# EAGLE design Op-amp Microphone Preamp (EAGLE 6.2)
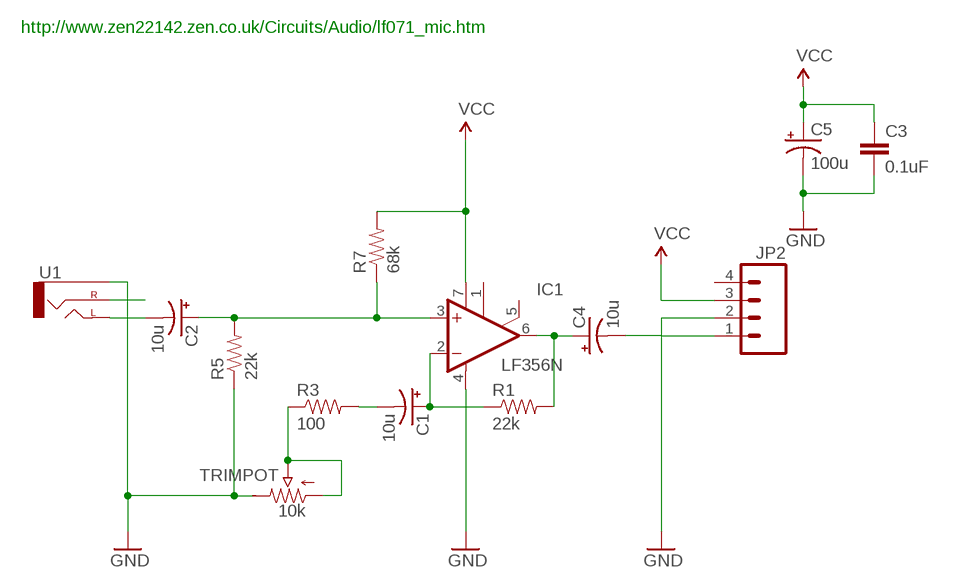
[diagram p0: schematic, sheet 1]

## Parts
C1  10u  CAP_POLPTH1  [CPOL-RADIAL-100UF-25V]
C2  10u  CAP_POLPTH1  [CPOL-RADIAL-100UF-25V]
C3  0.1uF  CAPPTH  [CAP-PTH-SMALL]
C4  10u  CAP_POLPTH1  [CPOL-RADIAL-100UF-25V]
C5  100u  CAP_POLPTH1  [CPOL-RADIAL-100UF-25V]
IC1  LF356N  [DIL08]
JP2  M04POLAR  [MOLEX-1X4]
R1  22k  RESISTORPTH-1/6W  [1/6W-RES]
R3  100  RESISTORPTH-1/6W  [1/6W-RES]
R5  22k  RESISTORPTH-1/6W  [1/6W-RES]
R7  68k  RESISTORPTH-1/6W  [1/6W-RES]
TRIMPOT  10k  POT100K_3362U  [3362U]
U1  AUDIO-JACKPTH  [AUDIO-JACK]

## Nets
GND: C3.2 C5.2(-) IC1.4(V-) JP2.2 R5.1 TRIMPOT.P$1(E) U1.SLEEVE
N$2: C1.2(-) R3.2
N$3: C4.1(+) IC1.6(OUT) R1.2
N$4: R3.1 TRIMPOT.P$2(S) TRIMPOT.P$3(A)
N$5: C1.1(+) IC1.2(-IN) R1.1
N$6: C2.1(+) IC1.3(+IN) R5.2 R7.1
N$8: C2.2(-) U1.TIP(LEFT)
N$9: U1.RING(RIGHT)
N$13: C4.2(-) JP2.1
VCC: C3.1 C5.1(+) IC1.7(V+) JP2.3 R7.2
Unconnected: IC1.1(BALANCE1) IC1.5(BALANCE2) JP2.4

## Notes on the sheet
- http://www.zen22142.zen.co.uk/Circuits/Audio/lf071_mic.htm

## Library data of the parts
C1 C2 C4 C5 = SparkFun:CAP_POL: Capacitor Polarized These are standard SMD and PTH capacitors. Normally 10uF, 47uF, and 100uF in electrolytic and tantalum varieties. Always verify the external diameter of the through hole cap, it varies with capacity, voltage, and manufacturer. The EIA devices should be standard.
C3 = SparkFun:CAP: Capacitor Standard 0603 ceramic capacitor, and 0.1" leaded capacitor.
IC1 = My Library:LF356: OP AMP
JP2 = SparkFun:M04: Header 4 Standard 4-pin 0.1" header. Use with straight break away headers (SKU : PRT-00116), right angle break away headers (PRT-00553), swiss pins (PRT-00743), machine pins (PRT-00117), and female headers (PRT-00115). Molex polarized connector foot print use with SKU : PRT-08231 with associated crimp pins and housings. 1MM SMD Version SKU: PRT-10208
R1 = My Library:RESISTOR: Resistor Basic schematic elements and footprints for 0603, 1206, and PTH resistors.
R3 R5 R7 = SparkFun:RESISTOR: Resistor Basic schematic elements and footprints for 0603, 1206, and PTH resistors.
TRIMPOT = My Library:POT
U1 = SparkFun:AUDIO-JACK: 3.5mm Audio Jack Simple 3.5mm common PCB mount audio jack. SKU: PRT-08032

## Board
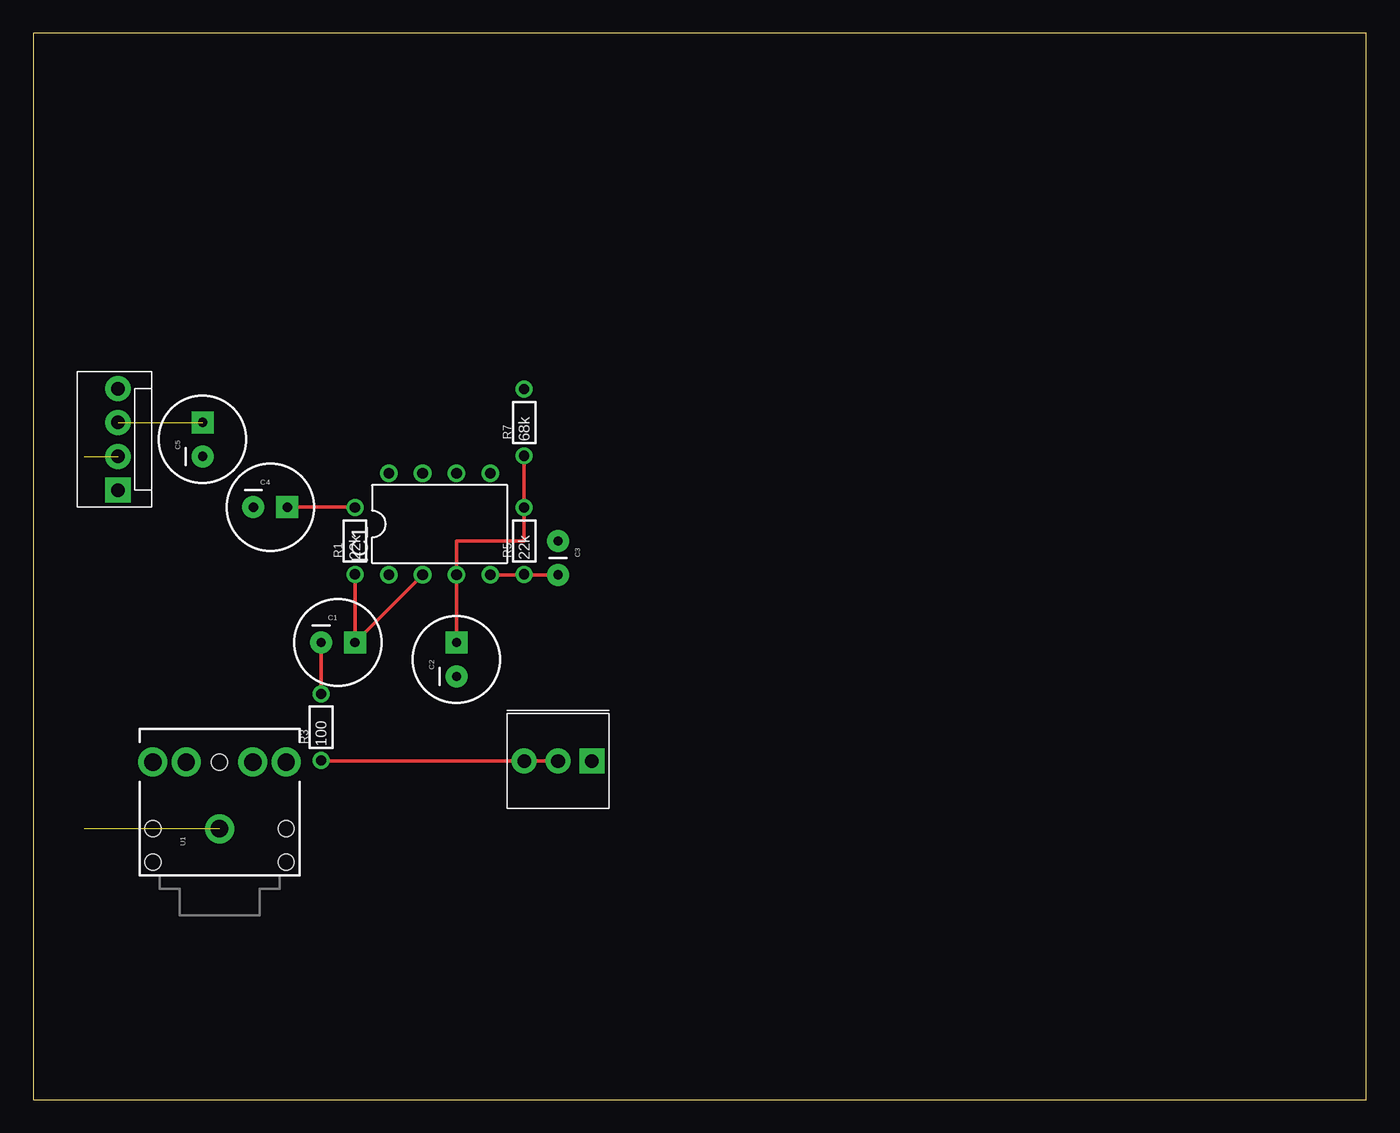
[diagram p1: board, top side]
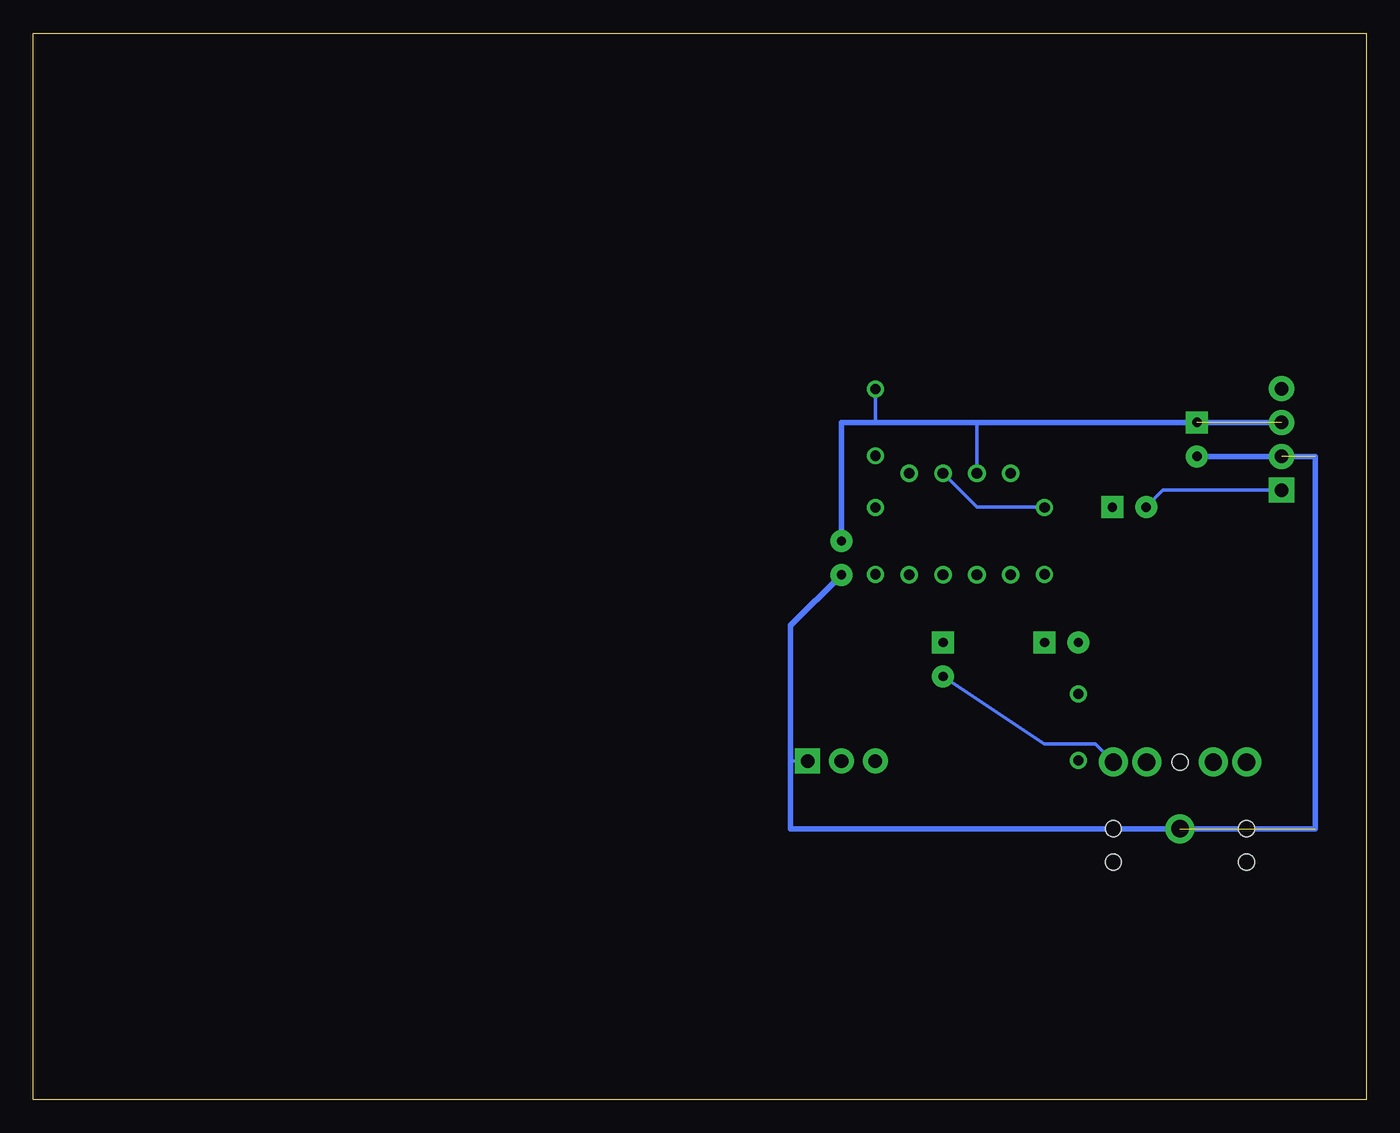
[diagram p2: board, bottom side, seen from below]

Size 100 x 80 mm. Coordinates in mm from the lower left corner, seen from the top.
Outline: 0,0 100,0 100,80 0,80 0,0
Copper layers (1*16): Top 0.035mm / dielectric 1.5mm / Bottom 0.035mm
Design rules: minimum track width 10mil, minimum drill 24mil, track to track 8mil, track to pad 8mil, pad to pad 8mil, via to via 8mil, smd to smd 8mil, copper to edge 40mil, drill to drill 8mil, minimum pad ring 10mil, minimum via ring 8mil, stop-mask expansion 4mil, vias tented up to drill 0mil, thermal gap 10mil

### Footprints (pad centres in the part's own frame; a part is rotated, then mirrored left to right if it is on the bottom)
CPOL-RADIAL-100UF-25V = drill 0.7 pad 1.651 square: 1 1.27,0 | drill 0.7 pad 1.651: 2 -1.27,0
CAP-PTH-SMALL = drill 0.7 pad 1.651: 1 0,0; 2 2.54,0
DIL08 = drill 0.813 pad 1.27: 1 -3.81,-3.81; 2 -1.27,-3.81; 3 1.27,-3.81; 4 3.81,-3.81; 5 3.81,3.81; 6 1.27,3.81; 7 -1.27,3.81; 8 -3.81,3.81
MOLEX-1X4 = drill 1.016 pad 1.88 square: 1 0,0 | drill 1.016 pad 1.88: 2 2.54,0; 3 5.08,0; 4 7.62,0
1/6W-RES = drill 0.762: 1 -2.5,0; 2 2.5,0
3362U = drill 1.016 pad 1.88 square: P$1 0,2.54 | drill 1.016 pad 1.88: P$2 2.54,2.54; P$3 5.08,2.54
AUDIO-JACK = drill 1.3 pad 2.184: RING 5,5; RSH 5,2.5; SLEEVE 0,0; TIP 5,-5; TSH 5,-2.5 | hole 1.2: 0,5; -2.5,5; -2.5,-5; 0,-5; 5,0

### Placement (x,y rotation side)
C1  22.86,34.29 0 top
C2  31.75,33.02 90 top
C3  39.37,41.91 270 top
C4  17.78,44.45 0 top
C5  12.7,49.53 90 top
IC1  30.48,43.18 0 top
JP2  6.35,45.72 90 top
R1  24.13,41.91 90 top
R3  21.59,27.94 90 top
R5  36.83,41.91 90 top
R7  36.83,50.8 90 top
TRIMPOT  41.91,27.94 180 top
U1  13.97,20.32 90 top

### Tracks (layer width: path | path; a pad name or v marks a point on that pad's centre or on a via)
GND  (2 unrouted)
  Top 0.254: IC1.4 C3.2 36.83,39.37 R5.1
  Bottom 0.254: 43.18,25.4 TRIMPOT.P$1
  Bottom 0.406: C5.2 3.81,48.26 3.81,20.32 41.91,20.32 43.18,20.32 43.18,25.4 43.18,35.56 C3.2
N$2
  Top 0.254: C1.2 21.59,30.48 R3.2
N$3
  Top 0.254: C4.1 24.13,44.45 R1.2
  Bottom 0.254: IC1.6 29.21,44.45 24.13,44.45 R1.2
N$4
  Top 0.254: R3.1 21.59,25.4 TRIMPOT.P$3 TRIMPOT.P$2
N$5
  Top 0.254: R1.1 24.13,39.37 C1.1 IC1.2
N$6
  Top 0.254: 36.83,41.91 36.83,44.45 R7.1 | 36.83,41.91 R5.2 | C2.1 IC1.3 31.75,41.91 36.83,41.91 | 36.83,41.91 R5.2 | 36.83,41.91 R5.2
N$8
  Bottom 0.254: C2.2 24.13,26.67 20.32,26.67 19.05,25.4 U1.TIP
N$13
  Bottom 0.254: C4.2 15.24,45.72 JP2.1
VCC  (1 unrouted)
  Bottom 0.254: 36.83,50.8 R7.2 | R7.2 36.83,53.34 R7.2 | 29.21,50.8 IC1.7
  Bottom 0.406: JP2.3 29.21,50.8 36.83,50.8 39.37,50.8 C3.1